# Altium project LTC3829_EVB.PrjPCB
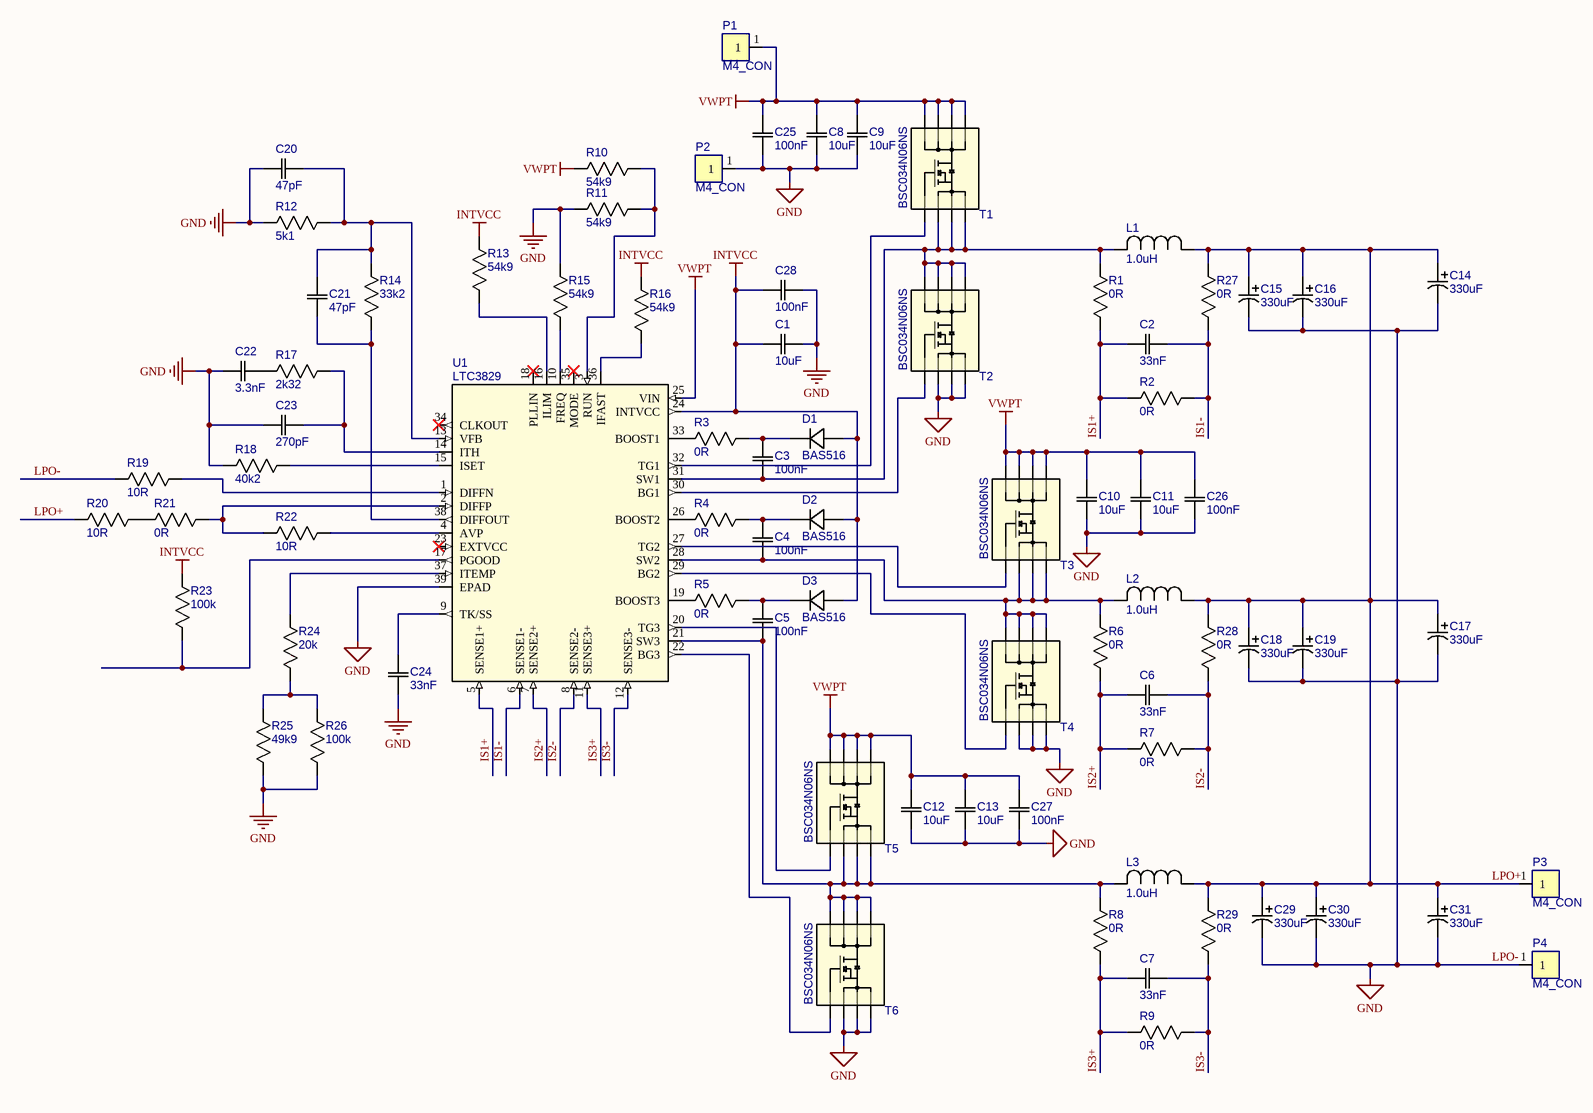
[diagram p0: LTC3829_EVB.SchDoc]
1 sheet, 77 parts. Net scope: global (net labels, ports and power ports of the same name join across sheets).
Board file: LTC3829_EVB.PcbDoc

## Sheet LTC3829_EVB.SchDoc
size A3

### Parts
C1  10uF  [C0603]
C2  33nF  [0402]
C3  100nF  [0402]
C4  100nF  [0402]
C5  100nF  [0402]
C6  33nF  [0402]
C7  33nF  [0402]
C8  10uF  [1210]
C9  10uF  [1210]
C10  10uF  [1210]
C11  10uF  [1210]
C12  10uF  [1210]
C13  10uF  [1210]
C14  330uF  [TAJD_AVX]
C15  330uF  [TAJD_AVX]
C16  330uF  [TAJD_AVX]
C17  330uF  [TAJD_AVX]
C18  330uF  [TAJD_AVX]
C19  330uF  [TAJD_AVX]
C20  47pF  [0402]
C21  47pF  [0402]
C22  3.3nF  [0402]
C23  270pF  [0402]
C24  33nF  [0402]
C25  100nF  [C0603]
C26  100nF  [C0603]
C27  100nF  [C0603]
C28  100nF  [0402]
C29  330uF  [TAJD_AVX]
C30  330uF  [TAJD_AVX]
C31  330uF  [TAJD_AVX]
D1  BAS516  [SOD-523]
D2  BAS516  [SOD-523]
D3  BAS516  [SOD-523]
L1  1.0uH  [L126X]
L2  1.0uH  [L126X]
L3  1.0uH  [L126X]
P1  M4_CON  [PCBComponent_1]
P2  M4_CON  [PCBComponent_1]
P3  M4_CON  [PCBComponent_1]
P4  M4_CON  [PCBComponent_1]
R1  0R  [0402]
R2  0R  [0402]
R3  0R  [0603]
R4  0R  [0603]
R5  0R  [0603]
R6  0R  [0402]
R7  0R  [0402]
R8  0R  [0402]
R9  0R  [0402]
R10  54k9  [0402]
R11  54k9  [0402]
R12  5k1  [0402]
R13  54k9  [0402]
R14  33k2  [0402]
R15  54k9  [0402]
R16  54k9  [0402]
R17  2k32  [0402]
R18  40k2  [0402]
R19  10R  [0402]
R20  10R  [0402]
R21  0R  [0402]
R22  10R  [0603]
R23  100k  [0402]
R24  20k  [0402]
R25  49k9  [0402]
R26  100k  [0402]
R27  0R  [0402]
R28  0R  [0402]
R29  0R  [0402]
T1  BSC034N06NS  [PQFNWB5x6]
T2  BSC034N06NS  [PQFNWB5x6]
T3  BSC034N06NS  [PQFNWB5x6]
T4  BSC034N06NS  [PQFNWB5x6]
T5  BSC034N06NS  [PQFNWB5x6]
T6  BSC034N06NS  [PQFNWB5x6]
U1  LTC3829  [QFN-38]

### Nets
INTVCC: C1.1 C28.2 D1.2 D2.2 D3.2 R13.2 R16.2 R23.2 U1.24(INTVCC)
LPO-: C1.2 C8.1 C9.1 C10.1 C11.1 C12.1 C13.1 C14.2 C15.2 C16.2 C17.2 C18.2 C19.2 C20.1 C22.1 C23.1 C24.1 C25.1 C26.1 C27.1 C28.1 C29.2 C30.2 C31.2 P2.1 P4.1 R11.2 R12.1 R15.2 R18.1 R19.1 R25.1 R26.1 T2.1 T2.2 T2.3 T4.1 T4.2 T4.3 T6.1 T6.2 T6.3 U1.39(EPAD)  [also labelled GND]
VWPT: C8.2 C9.2 C10.2 C11.2 C12.2 C13.2 C25.2 C26.2 C27.2 P1.1 R10.2 T1.5 T1.6 T1.7 T1.8 T3.5 T3.6 T3.7 T3.8 T5.5 T5.6 T5.7 T5.8 U1.25(VIN)
IS1+: C2.1 R1.1 R2.2 U1.5(SENSE1+)
IS1-: C2.2 R2.1 R27.1 U1.6(SENSE1-)
IS2+: C6.1 R6.1 R7.2 U1.7(SENSE2+)
IS2-: C6.2 R7.1 R28.1 U1.8(SENSE2-)
IS3+: C7.1 R8.1 R9.2 U1.11(SENSE3+)
IS3-: C7.2 R9.1 R29.1 U1.12(SENSE3-)
LPO+: C14.1 C15.1 C16.1 C17.1 C18.1 C19.1 C29.1 C30.1 C31.1 L1.1 L2.1 L3.1 P3.1 R20.1 R27.2 R28.2 R29.2
NetC3_1: C3.1 L1.2 R1.2 T1.1 T1.2 T1.3 T2.5 T2.6 T2.7 T2.8 U1.31(SW1)
NetC3_2: C3.2 D1.1 R3.2
NetC4_1: C4.1 L2.2 R6.2 T3.1 T3.2 T3.3 T4.5 T4.6 T4.7 T4.8 U1.28(SW2)
NetC4_2: C4.2 D2.1 R4.2
NetC5_1: C5.1 L3.2 R8.2 T5.1 T5.2 T5.3 T6.5 T6.6 T6.7 T6.8 U1.21(SW3)
NetC5_2: C5.2 D3.1 R5.2
NetC20_2: C20.2 C21.2 R12.2 R14.2 U1.13(VFB)
NetC21_1: C21.1 R14.1 U1.38(DIFFOUT)
NetC22_2: C22.2 R17.1
NetC23_2: C23.2 R17.2 U1.14(ITH)
NetC24_2: C24.2 U1.9(TK/SS)
NetR3_1: R3.1 U1.33(BOOST1)
NetR4_1: R4.1 U1.26(BOOST2)
NetR5_1: R5.1 U1.19(BOOST3)
NetR10_1: R10.1 R11.1 U1.3(RUN)
NetR13_1: R13.1 U1.16(ILIM)
NetR15_1: R15.1 U1.10(FREQ)
NetR16_1: R16.1 U1.36(IFAST)
NetR18_2: R18.2 U1.15(ISET)
NetR19_2: R19.2 U1.1(DIFFN)
NetR20_2: R20.2 R21.1
NetR21_2: R21.2 R22.1 U1.2(DIFFP)
NetR22_2: R22.2 U1.4(AVP)
NetR23_1: R23.1 U1.17(PGOOD)
NetR24_1: R24.1 R25.2 R26.2
NetR24_2: R24.2 U1.37(ITEMP)
NetT1_4: T1.4 U1.32(TG1)
NetT2_4: T2.4 U1.30(BG1)
NetT3_4: T3.4 U1.27(TG2)
NetT4_4: T4.4 U1.29(BG2)
NetT5_4: T5.4 U1.20(TG3)
NetT6_4: T6.4 U1.22(BG3)

Not connected (* = marked no-connect by the designer): U1 18(PLLIN)* 23(EXTVCC)* 34(CLKOUT)* 35(MODE)*

### Library data of the parts
C1 = OUDEIBUN_10uF_25V: OUDEIBUN / 25V 10% 106K X5R; Mfr. No: 106; ComponentLink1Description: taobao; ComponentLink1URL: https://detail.tmall.com/item.htm?abbucket=11&id=610884231672&rn=bfecce7903ee26d41e055cbdf2d2e6eb&skuId=4463564134688&spm=a1z10.3-b.w4011-22147617817.28.ed547d1efUUngR; Mfr.: OUDEIBUN; Price: 0.1
C2 C6 C7 C24 = OBEIDUN_33nF: 0402 33nF 333K 16V X7R; ComponentLink1Description: taobao; ComponentLink1URL: https://detail.tmall.com/item.htm?abbucket=11&id=610643367827&rn=485ffb871bba3336ec56bdf6e40ebf1b&skuId=4293224337085&spm=a1z10.3-b.w4011-22147617817.69.91e77d1e9KkI7E; Mfr.: OBEIDUN; Mfr. No: 333K; Price: 0.03
C3-C5 C28 = OBEIDUN_100nF: 0402 100NF 104K  50V X7R; ComponentLink1Description: taobao; ComponentLink1URL: https://detail.tmall.com/item.htm?abbucket=11&id=610169377419&rn=af8cc3c313be083494688299e412f071&skuId=4460562122099&spm=a1z10.3-b.w4011-22147617817.47.43b27d1eVfSLTc; Mfr.: OBEIDUN; Mfr. No: 104K; Price: 0.03
C8-C13 = OUBEIDUN_106_X7R: 1210 10UF 106K 100V X7R; Mfr. No: 10uF/100V; Mfr.: OUBEIDUN; Price: 0.6; ComponentLink1Description: taobao; ComponentLink1URL: https://detail.tmall.com/item.htm?_u=q10quk0k91e6&id=610720536810&spm=a1z09.2.0.0.680e2e8dgSrizI&skuId=4470822090146
C14-C19 C29-C31 = Auwah_330UF_7343: T520D337M006ATE010 / 6.3V 330uF 2917 20% ESR=10mOhms; Mfr.: Auwah; Mfr. No: T520D337M006ATE010; ComponentLink1Description: taobao; ComponentLink1URL: https://detail.tmall.com/item.htm?abbucket=13&id=667191138815&rn=40b330837969952154e49a258f1b3980&spm=a1z10.3-b-s.w4011-22886786001.43.16db5d54uS0uXf; Price: 1.8
C20 C21 = taobao_47pF: 47pF 50V C0G CL05C470JB5NN4C; Mfr.: Samsung; ComponentLink1Description: taobao; ComponentLink1URL: https://item.taobao.com/item.htm?spm=a1z09.2.0.0.10c82e8dL5BzWq&id=626312006030&_u=l10quk0kec5b; Mfr. No: CL05C470JB5NN4C; Price: 0.03
C22 = RAINPOLE_3n3F: RAINPOLE 0402 3.3nF 5% 50V NPO; Mfr. No: 332J; ComponentLink1Description: taobao; ComponentLink1URL: https://detail.tmall.com/item.htm?abbucket=11&id=577480004200&rn=e81fc7a7675914d6e9f82eba46a12cbb&skuId=3986690931936&spm=a1z10.3-b-s.w4011-12364813249.37.6d9c1ed6XWLE9d; Mfr.: RAINPOLE; Price: 0.04
C23 = OBEIDUN_270pF: 0402 270PF 50V 271J COG NPO; ComponentLink1Description: taobao; ComponentLink1URL: https://detail.tmall.com/item.htm?_u=i10quk0k236b&id=609326685150&spm=a1z09.2.0.0.485e2e8ddN1cee; Mfr.: OBEIDUN; Mfr. No: 271J; Price: 0.02
C25-C27 = OUDEIBUN_100nF: 0603 100NF 50V 10% 104K X7R; ComponentLink1Description: taobao; ComponentLink1URL: https://detail.tmall.com/item.htm?_u=p10quk0k2f35&id=610651934672&spm=a1z09.2.0.0.77b12e8d9iVia0&skuId=4463522550238; Mfr.: OUDEIBUN; Mfr. No: 104K; Price: 0.025
D1-D3 = OBEIDUN_BAS516: SOD-523 100V/250mA; Mfr. No: BAS516,61; Mfr.: OBEIDUN; ComponentLink1Description: taobao; ComponentLink1URL: https://detail.tmall.com/item.htm?abbucket=11&id=627344864030&rn=9e03fb0dc0c82be40d648479edaa9265&skuId=4457291933929&spm=a1z10.3-b.w4011-22147617817.46.572e7d1eRfO8kn; Price: 0.14
L1-L3 = L1260_102: HC1260 1R0M; Mfr.: HuiCi; Mfr. No: EPC1265_1R0; Price: 1.4; ComponentLink1Description: taobao; ComponentLink1URL: https://item.taobao.com/item.htm?id=727903070323&spm=a1z0d.6639537/tb.1997196601.22.15e27484tAONUM&skuId=5218005750787
P1-P4 = M4_CON: Mfr.: LFX; Mfr. No: PCB-10-4; ComponentLink1Description: taobao; ComponentLink1URL: https://item.taobao.com/item.htm?spm=a1z09.2.0.0.45712e8dxvwLo5&id=531030902005&_u=s10quk0k994a; Price: 0.41
R1 R2 R6-R9 R21 R27-R29 = OUDEIBUN_0R: OUDEIBUN / 0R 1% 1/16W; ComponentLink1Description: taobao; ComponentLink1URL: https://detail.tmall.com/item.htm?abbucket=11&id=609078082053&rn=dd22835191e181ef543cf6f0827e8de3&spm=a1z10.3-b.w4011-22147617817.40.1e787d1eBkSpf5&skuId=4447040574382; Mfr.: OUDEIBUN; Mfr. No: 0R; Price: 0.02
R3-R5 = 0R: 0R 1/10W +/-1%; Mfr.: UNIOHM; Mfr. No: 0R; Price: 0.016; ComponentLink1Description: taobao; ComponentLink1URL: https://item.taobao.com/item.htm?spm=a1z10.3-c-s.w4002-24706531953.10.66736a4boyPN1N&id=584519288165
R10 R11 R13 R15 R16 = OUDEIBUN_54k9: OUDEIBUN / 54k9 1% 1/16W; ComponentLink1Description: taobao; ComponentLink1URL: https://detail.tmall.com/item.htm?_u=o10quk0kdcf3&id=656225085848&spm=a1z09.2.0.0.570c2e8dmKgpe8&skuId=4738665253533; Mfr.: OUDEIBUN; Mfr. No: 54k9; Price: 0.02
R12 = UNIOHM_5k1: UNIOHM / 5k1 1% 1/16W; ComponentLink1Description: taobao; ComponentLink1URL: https://item.taobao.com/item.htm?spm=a1z10.3-c-s.w4002-24706531953.9.138b6a4bJ0dszP&id=525568819310; Mfr.: UNIOHM; Mfr. No: 5k1; Price: 0.012
R14 = OUDEIBUN_33k2: OUDEIBUN / 33k2 1% 1/16W; ComponentLink1Description: taobao; ComponentLink1URL: https://detail.tmall.com/item.htm?_u=o10quk0kba15&id=656995123026&skuId=4912165283327&spm=a1z09.2.0.0.570c2e8dmKgpe8; Mfr.: OUDEIBUN; Mfr. No: 33k2; Price: 0.02
R17 = OUDEIBUN_2k32: OUDEIBUN / 1% 2k32; ComponentLink1Description: taobao; ComponentLink1URL: https://detail.tmall.com/item.htm?abbucket=11&id=656536146329&rn=bf53b30befa5ed8f787b08dfd1b2b8b6&spm=a1z10.3-b.w4011-22147617817.17.25bf7d1eVTNJfJ&skuId=4738244393253; Mfr.: OUDEIBUN; Mfr. No: 2k32; Price: 0.02
R18 = UNIOHM_40k2: UNIOHM / 40k2 1% 1/16W; ComponentLink1Description: taobao; ComponentLink1URL: https://item.taobao.com/item.htm?spm=a1z10.3-c-s.w4002-24706531953.9.4cff6a4bFcr7uh&id=525646732568; Mfr.: UNIOHM; Mfr. No: 40k2; Price: 0.012
R19 R20 = OUDEIBUN_10R: OUDEIBUN / 10R 1% 1/16W; ComponentLink1Description: taobao; ComponentLink1URL: https://detail.tmall.com/item.htm?abbucket=13&id=609079314556&rn=b6a4437db4d3682110499690578ce2c9&spm=a1z10.3-b.w4011-22147617817.60.4da17d1eMkQQ60&skuId=4279701997786; Mfr.: OUDEIBUN; Mfr. No: 10R; Price: 0.02
R22 = ARG03DTC0100: 10R 1/10W +/-0.5%; Mfr.: Viking; Mfr. No: ARG03DTC0100; Price: 0.044; ComponentLink1Description: taobao; ComponentLink1URL: https://item.taobao.com/item.htm?spm=a1z09.2.0.0.6e162e8dlKCeMq&id=632526730087&_u=c10quk0k836f
R23 R26 = OUDEIBUN_100k: OUDEIBUN / 1% 100k; Mfr.: UNIOHM; ComponentLink1Description: taobao; ComponentLink1URL: https://detail.tmall.com/item.htm?abbucket=11&id=608928061564&rn=6cabffb4bef601fc6d0198b0cb480a08&spm=a1z10.3-b.w4011-22147617817.51.20d47d1eFEZrXW&skuId=4280827589222; Mfr. No: 100k; Price: 0.02
R24 = OUDEIBUN_20k: OUDEIBUN / 20k 1% 1/16W; ComponentLink1Description: taobao; ComponentLink1URL: https://detail.tmall.com/item.htm?_u=310quk0k3cbb&id=656218957556&skuId=4912158475127&spm=a1z09.2.0.0.d5442e8dvaKsoM; Mfr.: OUDEIBUN; Mfr. No: 20k; Price: 0.02
R25 = OUDEIBUN_49k9: OUDEIBUN / 1% 49k9; ComponentLink1Description: taobao; ComponentLink1URL: https://detail.tmall.com/item.htm?id=656225085848&spm=a1z0d.6639537/tb.1997196601.28.44b47484EuWcRC&skuId=4738665253528; Mfr.: OUDEIBUN; Mfr. No: 49k9; Price: 0.02
T1-T6 = BSC034N06NS: MPower Transistor, 60V; Mfr.: Infineon Technologies; Mfr. No: BSC034N06NS; ComponentLink1Description: taobao; ComponentLink1URL: https://detail.tmall.com/item.htm?abbucket=12&id=712516353118&ns=1&spm=a21n57.1.0.0.5a70523ceCAuo0&skuId=4992670365636; Price: 4.5
U1 = LTC3829EUHFPBF: 3-Phase, Single Output Synchronous / Step-Down DC/DC Controller with Diffamp; Mfr.: Analog Devices Inc; Price: 24; Mfr. No: LTC3829; ComponentLink1Description: taobao; ComponentLink1URL: https://item.taobao.com/item.htm?id=679551160665&spm=a1z0d.6639537/tb.1997196601.14.6d377484hToNF8&sku_properties=1627207:426840251